# Altium schematic sheet PowerSupply.SchDoc
size A4; SheetNumber: 5; SheetTotal: 6
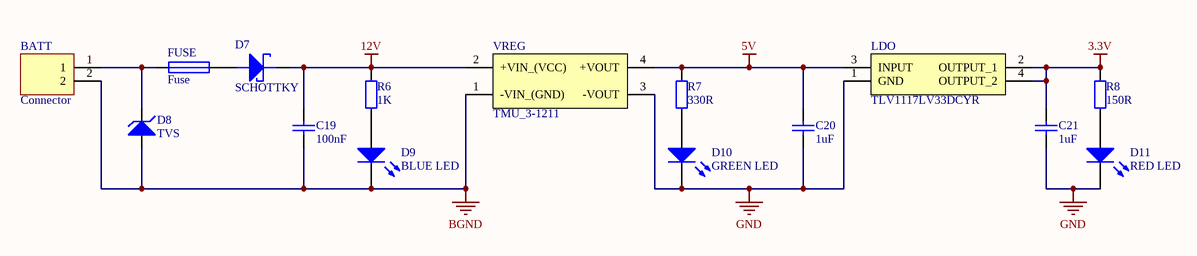
[diagram p0: PowerSupply.SchDoc]

## Parts
BATT  Connector  [CONN2_SORK_3.5mm]
C19  100nF  [FP_0805_CAP_085]
C20  1uF  [FP_0805_CAP_085]
C21  1uF  [FP_0805_CAP_085]
D7  SCHOTTKY  [FP_SMA]
D8  TVS  [FP_SMB]
D9  BLUE LED  [LED_SMD_0805_BLUE]
D10  GREEN LED  [LED_SMD_0805_GREEN]
D11  RED LED  [LED_SMD_0805_RED]
FUSE  Fuse  [ECE BU110 PolyFuse]
LDO  TLV1117LV33DCYR  [SOT230P700X180-4N]
R6  1K  [FP_0805_RES]
R7  330R  [FP_0805_RES]
R8  150R  [FP_0805_RES]
VREG  TMU_3-1211  [TMU31211]

## Nets
3.3V: C21.2 LDO.2(OUTPUT_1) LDO.4(OUTPUT_2) R8.2
5V: C20.2 LDO.3(INPUT) R7.2 VREG.4(+VOUT)
12V: C19.2 D7.K(CATHODE) R6.2 VREG.2(+VIN_(VCC))
BGND: BATT.2 C19.1 D8.A D9.K VREG.1(-VIN_(GND))
GND: C20.1 C21.1 D10.K D11.K LDO.1(GND) VREG.3(-VOUT)
NetBATT_1: BATT.1 D8.K FUSE.1
NetD7_A: D7.A(ANODE) FUSE.2
NetD9_A: D9.A R6.1
NetD10_A: D10.A R7.1
NetD11_A: D11.A R8.1

## Library data of the parts
BATT = Connector_2pin: 2pin connector
C19-C21 = CAP: Capacitor
  C19: Value: 100nF
  C20 C21: Value: 1uF
D7 = SCHOTTKY: Schottky diode
D8 = ZENER: TVS Diode
D9-D11 = LED: Typical RED GaAs LED
LDO = TLV1117LV33DCYR: 1-A, Positive Fixed Voltage, Low-Dropout Regulator; Manufacturer_Name: Texas Instruments; Geometry.Height: 1.8mm; Mouser Part Number: 595-TLV1117LV33DCYR; Mouser Price/Stock: https://www.mouser.co.uk/ProductDetail/Texas-Instruments/TLV1117LV33DCYR?qs=tEz3BkPb1rwzXMb8FiWhow%3D%3D; Manufacturer_Part_Number: TLV1117LV33DCYR; Datasheet Link: http://www.ti.com/lit/gpn/tlv1117lv
R6-R8 = RES: Resistor
  R6: Value: 1K
  R7: Value: 330R
  R8: Value: 150R
VREG = TMU_3-1211: 3 Watt DC/DC converter, industrial, +/-10% input, short circuit protection, unregulated, encapsulated, SIP-4; Manufacturer_Name: Traco Power; Manufacturer_Part_Number: TMU 3-1211; Geometry.Height: 10.7mm; Mouser Part Number: 495-TMU3-1211; Mouser Price/Stock: https://www.mouser.co.uk/ProductDetail/TRACO-Power/TMU-3-1211?qs=By6Nw2ByBD3GesUHA2ql3Q%3D%3D; Datasheet Link: https://tracopower.com/tmu3-datasheet/